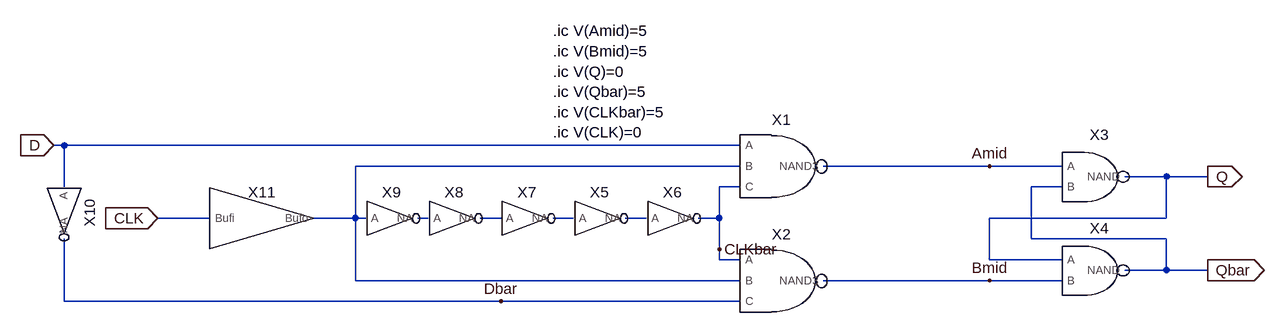
[diagram p0: schematic dff.asc]
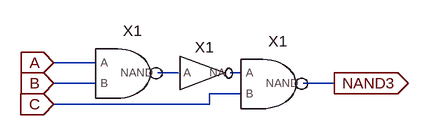
[diagram p1: sub-circuit nand3.asc]
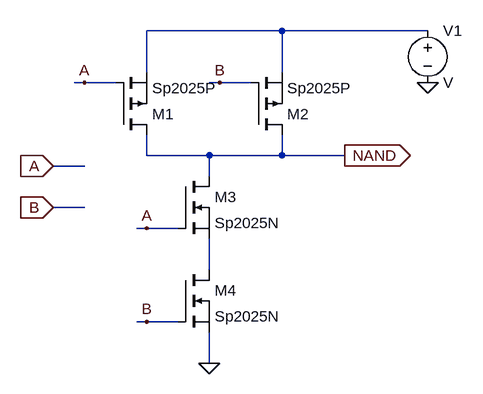
[diagram p2: sub-circuit nand.asc]
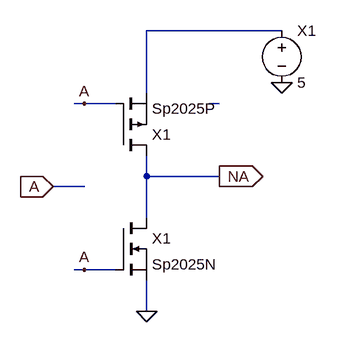
[diagram p3: sub-circuit invert.asc]
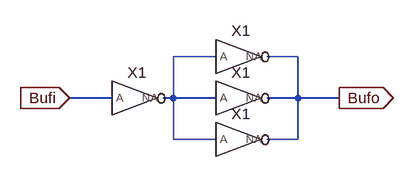
[diagram p4: sub-circuit buffer.asc]
dff.asc, the LTspice schematic file:
Version 4.1.1
SHEET 1 980 680
WIRE -896 64 -912 64
WIRE 144 64 -896 64
WIRE 144 96 -448 96
WIRE 528 96 272 96
WIRE 640 96 528 96
WIRE 800 112 736 112
WIRE 864 112 800 112
WIRE -896 128 -896 64
WIRE 144 128 112 128
WIRE 640 128 592 128
WIRE -672 176 -752 176
WIRE -448 176 -448 96
WIRE -448 176 -512 176
WIRE -432 176 -448 176
WIRE -336 176 -352 176
WIRE -224 176 -256 176
WIRE -112 176 -144 176
WIRE 0 176 -32 176
WIRE 112 176 112 128
WIRE 112 176 80 176
WIRE 800 176 800 112
WIRE 800 176 528 176
WIRE 592 208 592 128
WIRE 800 208 592 208
WIRE 112 224 112 176
WIRE 112 240 112 224
WIRE 144 240 112 240
WIRE 528 240 528 176
WIRE 640 240 528 240
WIRE 800 256 800 208
WIRE 800 256 736 256
WIRE 864 256 800 256
WIRE -448 272 -448 176
WIRE 144 272 -448 272
WIRE 528 272 272 272
WIRE 640 272 528 272
WIRE -896 304 -896 208
WIRE -224 304 -896 304
WIRE 144 304 -224 304
FLAG -912 64 D
IOPIN -912 64 In
FLAG -752 176 CLK
IOPIN -752 176 In
FLAG 864 112 Q
IOPIN 864 112 Out
FLAG 864 256 Qbar
IOPIN 864 256 Out
FLAG -224 304 Dbar
FLAG 528 96 Amid
FLAG 528 272 Bmid
FLAG 112 224 CLKbar
SYMBOL NAND3 208 96 R0
SYMATTR InstName X1
SYMBOL NAND3 208 272 R0
SYMATTR InstName X2
SYMBOL INVERT -192 176 R0
SYMATTR InstName X7
SYMBOL INVERT -304 176 R0
SYMATTR InstName X8
SYMBOL INVERT -400 176 R0
SYMATTR InstName X9
SYMBOL NAND 688 112 R0
SYMATTR InstName X3
SYMBOL NAND 688 256 R0
SYMATTR InstName X4
SYMBOL INVERT -896 160 R90
SYMATTR InstName X10
SYMBOL INVERT -80 176 R0
SYMATTR InstName X5
SYMBOL INVERT 32 176 R0
SYMATTR InstName X6
SYMBOL Buffer -592 176 R0
SYMATTR InstName X11
TEXT -144 -112 Left 2 !.ic V(Amid)=5\n.ic V(Bmid)=5\n.ic V(Q)=0\n.ic V(Qbar)=5\n.ic V(CLKbar)=5\n.ic V(CLK)=0

nand3.asc, the sub-circuit schematic file:
Version 4
SHEET 1 880 680
WIRE 80 80 16 80
WIRE 208 96 176 96
WIRE 304 96 288 96
WIRE 80 112 16 112
WIRE 448 112 400 112
WIRE 304 128 256 128
WIRE 256 144 256 128
WIRE 256 144 16 144
FLAG 16 80 A
IOPIN 16 80 In
FLAG 16 112 B
IOPIN 16 112 In
FLAG 16 144 C
IOPIN 16 144 In
FLAG 448 112 NAND3
IOPIN 448 112 Out
SYMBOL NAND 128 96 R0
SYMATTR InstName X1
SYMBOL NAND 352 112 R0
SYMATTR InstName X1
SYMBOL INVERT 240 96 R0
SYMATTR InstName X1

nand.asc, the sub-circuit schematic file:
Version 4
SHEET 1 880 680
.lib SHEET 1 880 680
WIRE 336 -160 128 -160
WIRE 560 -160 336 -160
WIRE 128 -96 128 -160
WIRE 336 -96 336 -160
WIRE 32 -80 16 -80
WIRE 80 -80 32 -80
WIRE 240 -80 224 -80
WIRE 288 -80 240 -80
WIRE 128 32 128 0
WIRE 224 32 128 32
WIRE 336 32 336 0
WIRE 336 32 224 32
WIRE 432 32 336 32
WIRE 32 48 -16 48
WIRE 224 64 224 32
WIRE 32 112 -16 112
WIRE 128 144 112 144
WIRE 176 144 128 144
WIRE 224 208 224 160
WIRE 128 288 112 288
WIRE 176 288 128 288
WIRE 224 352 224 304
FLAG 224 352 0
FLAG -16 48 A
IOPIN -16 48 In
FLAG -16 112 B
IOPIN -16 112 In
FLAG 128 144 A
FLAG 128 288 B
FLAG 32 -80 A
FLAG 240 -80 B
FLAG 432 32 NAND
IOPIN 432 32 Out
FLAG 560 -80 0
SYMBOL pmos 80 0 M180
SYMATTR InstName M1
SYMATTR Value Sp2025P
SYMBOL pmos 288 0 M180
SYMATTR InstName M2
SYMATTR Value Sp2025P
SYMBOL nmos 176 64 R0
SYMATTR InstName M3
SYMATTR Value Sp2025N
SYMBOL nmos 176 208 R0
SYMATTR InstName M4
SYMATTR Value Sp2025N
SYMBOL voltage 560 -176 R0
SYMATTR InstName V1

invert.asc, the sub-circuit schematic file:
Version 4
SHEET 1 880 680
WIRE 352 -80 144 -80
WIRE 144 16 144 -80
WIRE 48 32 32 32
WIRE 96 32 48 32
WIRE 256 32 240 32
WIRE 144 144 144 112
WIRE 256 144 144 144
WIRE 48 160 0 160
WIRE 144 208 144 144
WIRE 48 288 32 288
WIRE 96 288 48 288
WIRE 144 352 144 304
FLAG 144 352 0
FLAG 0 160 A
IOPIN 0 160 In
FLAG 48 288 A
FLAG 48 32 A
FLAG 256 144 NA
IOPIN 256 144 Out
FLAG 352 0 0
SYMBOL pmos 96 112 M180
SYMATTR InstName X1
SYMATTR Value Sp2025P
SYMBOL nmos 96 208 R0
SYMATTR InstName X1
SYMATTR Value Sp2025N
SYMBOL voltage 352 -96 R0
SYMATTR InstName X1
SYMATTR Value 5

buffer.asc, the sub-circuit schematic file:
Version 4
SHEET 1 880 680
WIRE 224 64 160 64
WIRE 352 64 304 64
WIRE 64 128 0 128
WIRE 160 128 160 64
WIRE 160 128 144 128
WIRE 224 128 160 128
WIRE 352 128 352 64
WIRE 352 128 304 128
WIRE 416 128 352 128
WIRE 160 192 160 128
WIRE 224 192 160 192
WIRE 352 192 352 128
WIRE 352 192 304 192
FLAG 0 128 Bufi
IOPIN 0 128 In
FLAG 416 128 Bufo
IOPIN 416 128 Out
SYMBOL INVERT 96 128 R0
SYMATTR InstName X1
SYMBOL INVERT 256 64 R0
SYMATTR InstName X1
SYMBOL INVERT 256 128 R0
SYMATTR InstName X1
SYMBOL INVERT 256 192 R0
SYMATTR InstName X1

The netlist it stands for:
* dff.asc
XX1 D N001 CLKbar Amid nand3
XX2 CLKbar N001 Dbar Bmid nand3
XX7 N003 N004 invert
XX8 N002 N003 invert
XX9 N001 N002 invert
XX3 Amid Qbar Q nand
XX4 Q Bmid Qbar nand
XX10 D Dbar invert
XX5 N004 N005 invert
XX6 N005 CLKbar invert
XX11 CLK N001 buffer

* block symbol definitions
.subckt nand3 A B C NAND3
XX1 A B N001 nand
XX1 N002 C NAND3 nand
XX1 N001 N002 invert
.ends nand3

.subckt nand A B NAND
M1 NAND A N001 N001 Sp2025P
M2 NAND B N001 N001 Sp2025P
M3 NAND A N002 N002 Sp2025N
M4 N002 B 0 0 Sp2025N
V1 N001 0 V
.ends nand

.subckt invert A NA
M§X1 NA A N001 N001 Sp2025P
M§X1 NA A 0 0 Sp2025N
V§X1 N001 0 5
.ends invert

.subckt buffer Bufi Bufo
XX1 Bufi N001 invert
XX1 N001 Bufo invert
XX1 N001 Bufo invert
XX1 N001 Bufo invert
.ends buffer

.model NMOS NMOS
.model PMOS PMOS
.lib standard.mos
.ic V(Amid)=5
.ic V(Bmid)=5
.ic V(Q)=0
.ic V(Qbar)=5
.ic V(CLKbar)=5
.ic V(CLK)=0
.backanno
.end